# EAGLE design Kite-AVR-ATmega328p (EAGLE 6.5.0)
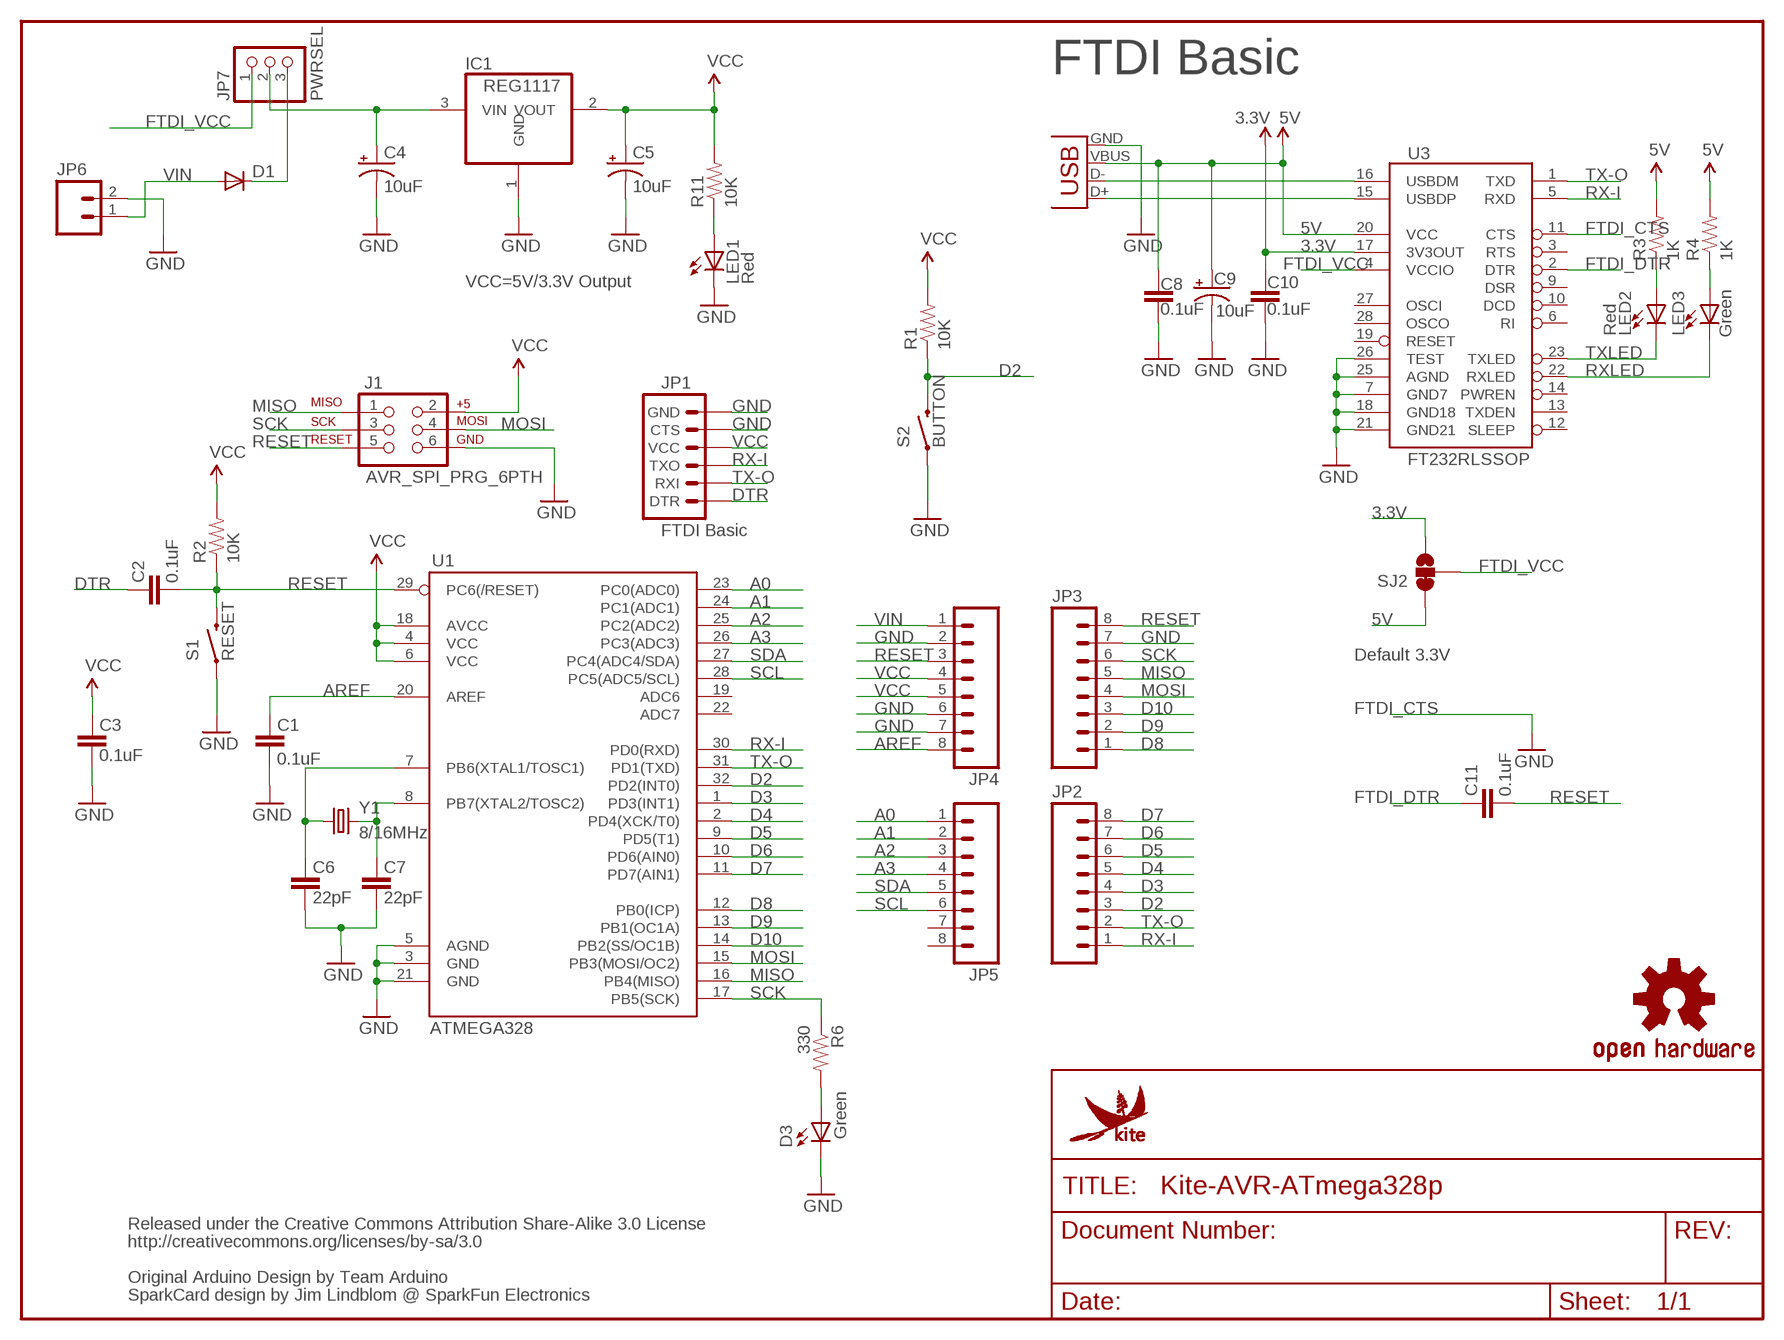
[diagram p0: schematic, sheet 1]

## Parts
C1  0.1uF  CAP0603-CAP  [0603-CAP]
C2  0.1uF  CAP0603-CAP  [0603-CAP]
C3  0.1uF  CAP0603-CAP  [0603-CAP]
C4  10uF  CAP_POL1206  [EIA3216]
C5  10uF  CAP_POL1206  [EIA3216]
C6  22pF  CAP0603-CAP  [0603-CAP]
C7  22pF  CAP0603-CAP  [0603-CAP]
C8  0.1uF  CAP0603-CAP  [0603-CAP]
C9  10uF  CAP_POL1206  [EIA3216]
C10  0.1uF  CAP0603-CAP  [0603-CAP]
C11  0.1uF  CAP0603-CAP  [0603-CAP]
D1  DIODESMA  [SMA-DIODE]
D3  Green  LED0603  [LED-0603]
IC1  REG1117  [SOT223]
J1  AVR_SPI_PRG_6PTH  [2X3]
JP1  FTDI Basic  KITE-FTDI  [KITE-FTDI]
JP2  M081X08  [1X08]
JP3  M081X08  [1X08]
JP4  M081X08  [1X08]
JP5  M081X08  [1X08]
JP6  M02POLAR  [MOLEX-1X2]
JP7  PWRSEL  PINHD-1X3  [1X03]
LED1  Red  LED0603  [LED-0603]
LED2  Red  LED0603  [LED-0603]
LED3  Green  LED0603  [LED-0603]
LOGO1  OSHW-LOGOS  [OSHW-LOGO-S]
R1  10K  RESISTOR0603-RES  [0603-RES]
R2  10K  RESISTOR0603-RES  [0603-RES]
R3  1K  RESISTOR0603-RES  [0603-RES]
R4  1K  RESISTOR0603-RES  [0603-RES]
R6  330  RESISTOR0603-RES  [0603-RES]
R11  10K  RESISTOR0603-RES  [0603-RES]
S1  RESET  SWITCH-MOMENTARY-2-SMD-1101NE  [TACTILE-SWITCH-1101NE]
S2  BUTTON  SWITCH-MOMENTARY-2-SMD-1101NE  [TACTILE-SWITCH-1101NE]
SJ2  SOLDERJUMPER_2WAYS  [SJ_3]
U1  ATMEGA328  ATMEGA168  [TQFP32-08]
U3  FT232RLSSOP  [SSOP28DB]
U$4  KITE-LOGO-AVR-MEDIUM  [KITE-AVR-LOGO-MEDIUM]
X2  USB-SMD-NS  [USB-MINIB-NOSTOP]
Y1  8/16MHz  CRYSTAL5X3  [CRYSTAL-SMD-5X3]

## Nets
3.3V [power]: C10.1 SJ2.3 U3.17(3V3OUT)
5V: C8.1 C9.A(+) R3.2 R4.2 SJ2.1 U3.20(VCC) X2.VBUS
A0: JP5.1 U1.23(PC0(ADC0))
A1: JP5.2 U1.24(PC1(ADC1))
A2: JP5.3 U1.25(PC2(ADC2))
A3: JP5.4 U1.26(PC3(ADC3))
AREF: C1.2 JP4.8 U1.20(AREF)
D2: JP2.3 R1.1 S2.P$2 U1.32(PD2(INT0))
D3: JP2.4 U1.1(PD3(INT1))
D4: JP2.5 U1.2(PD4(XCK/T0))
D5: JP2.6 U1.9(PD5(T1))
D6: JP2.7 U1.10(PD6(AIN0))
D7: JP2.8 U1.11(PD7(AIN1))
D8: JP3.1 U1.12(PB0(ICP))
D9: JP3.2 U1.13(PB1(OC1A))
D10: JP3.3 U1.14(PB2(SS/OC1B))
DTR: C2.2 JP1.1(DTR)
FTDI_CTS: U3.11(CTS) ; supply symbol labelled GND
FTDI_DTR: C11.2 U3.2(DTR)
FTDI_VCC: JP7.1 SJ2.2 U3.4(VCCIO)
GND [power]: C1.1 C3.1 C4.C(-) C5.C(-) C6.1 C7.1 C8.2 C9.C(-) C10.2 D3.C IC1.1(GND) J1.6 JP1.5(CTS) JP1.6(GND) JP3.7 JP4.2 JP4.6 JP4.7 JP6.2 LED1.C S1.P$1 S2.P$1 U1.3(GND) U1.5(AGND) U1.21(GND) U3.7(GND7) U3.18(GND18) U3.21(GND21) U3.25(AGND) U3.26(TEST) X2.GND
MISO: J1.1 JP3.5 U1.16(PB4(MISO))
MOSI: J1.4 JP3.4 U1.15(PB3(MOSI/OC2))
N$1: C7.2 U1.8(PB7(XTAL2/TOSC2)) Y1.3
N$2: C6.2 U1.7(PB6(XTAL1/TOSC1)) Y1.1
N$3: LED2.A R3.1
N$4: C4.A(+) IC1.3(VIN) JP7.2
N$5: LED3.A R4.1
N$7: D3.A R6.2
N$8: D1.C JP7.3
N$38: LED1.A R11.1
RESET: C2.1 C11.1 J1.5 JP3.8 JP4.3 R2.1 S1.P$2 U1.29(PC6(/RESET))
RX-I: JP1.3(TXO) JP2.1 U1.30(PD0(RXD)) U3.5(RXD)
RXLED: LED3.C U3.22(RXLED)
SCK: J1.3 JP3.6 R6.1 U1.17(PB5(SCK))
SCL: JP5.6 U1.28(PC5(ADC5/SCL))
SDA: JP5.5 U1.27(PC4(ADC4/SDA))
TX-O: JP1.2(RXI) JP2.2 U1.31(PD1(TXD)) U3.1(TXD)
TXLED: LED2.C U3.23(TXLED)
USB_D+: U3.15(USBDP) X2.D+
USB_D-: U3.16(USBDM) X2.D-
VCC [power]: C3.2 C5.A(+) IC1.2(VOUT) J1.2 JP1.4(VCC) JP4.4 JP4.5 R1.2 R2.2 R11.2 U1.4(VCC) U1.6(VCC) U1.18(AVCC)
VIN [power]: D1.A JP4.1 JP6.1
Unconnected: JP5.7 JP5.8 U1.19(ADC6) U1.22(ADC7) U3.3(RTS) U3.6(RI) U3.9(DSR) U3.10(DCD) U3.12(SLEEP) U3.13(TXDEN) U3.14(PWREN) U3.19(RESET) U3.27(OSCI) U3.28(OSCO)

## Notes on the sheet
- FTDI Basic
- VCC=5V/3.3V Output
- Default 3.3V
- Released under the Creative Commons Attribution Share-Alike 3.0 License
- http://creativecommons.org/licenses/by-sa/3.0
- Original Arduino Design by Team Arduino
- SparkCard design by Jim Lindblom @ SparkFun Electronics

## Library data of the parts
C1-C3 C6-C8 C10 C11 = SparkFun:CAP: Capacitor Standard 0603 ceramic capacitor, and 0.1" leaded capacitor.
C4 C5 C9 = SparkFun:CAP_POL: Capacitor Polarized These are standard SMD and PTH capacitors. Normally 10uF, 47uF, and 100uF in electrolytic and tantalum varieties. Always verify the external diameter of the through hole cap, it varies with capacity, voltage, and manufacturer. The EIA devices should be standard.
D1 = SparkFun-DiscreteSemi:DIODE: Diode These are standard reverse protection diodes and small signal diodes. SMA package can handle up to about 1A. SOD-323 can handle about 200mA. What the SOD-323 package when ordering, there are some mfgs out there that are 5-pin packages.
D3 LED1-LED3 = SparkFun:LED: LEDs Standard schematic elements and footprints for 5mm, 3mm, 1206, and 0603 sized LEDs. 5mm - Spark Fun Electronics SKU : COM-00529 (and others)
IC1 = burr-brown:REG1117: 800mA and 1A Low Dropout (LDO) Positive Regulator 1.8V, 2.5V, 2.85V, 3.3V, 5V, and Adj; MPN: REG1117; OC_FARNELL: 1097566; OC_NEWARK: 14P6981
J1 = SparkFun-Connectors:AVR_SPI_PRG_6: AVR ISP 6 Pin This is the reduced ISP connector for AVR programming. Common on Arduino. This footprint will take up less PCB space and can be used with a 10-pin to 6-pin adapter such as SKU: BOB-08508
JP1 = Kite:KITE-FTDI
JP2-JP5 = SparkFun-Connectors:M08: Header 8 Standard 8-pin 0.1" header. Use with straight break away headers (SKU : PRT-00116), right angle break away headers (PRT-00553), swiss pins (PRT-00743), machine pins (PRT-00117), and female headers (PRT-00115).
JP6 = SparkFun-Connectors:M02: Header 2 Standard 2-pin 0.1" header. Use with straight break away headers (SKU : PRT-00116), right angle break away headers (PRT-00553), swiss pins (PRT-00743), machine pins (PRT-00117), and female headers (PRT-00115). Molex polarized connector foot print use with SKU : PRT-08233 with associated crimp pins and housings.
JP7 = adafruit:PINHD-1X3: PIN HEADER
LOGO1 = SparkFun-Aesthetics:OSHW-LOGO: Open Source Hardware Logo This logo indicates the piece of hardware it is found on incorporates a OSHW license and/or adheres to the definition of open source hardware found here: http://freedomdefined.org/OSHW
R1-R4 R6 R11 = SparkFun:RESISTOR: Resistor Basic schematic elements and footprints for 0603, 1206, and PTH resistors.
S1 S2 = SparkFun-Electromechanical:SWITCH-MOMENTARY-2: Various NO switches- pushbuttons, reed, etc
SJ2 = SparkFun:SOLDERJUMPER_2WAY: Solder Jumper 2 way solder jumper
U1 = SparkFun:ATMEGA168
U3 = SparkFun:FT232RL: USB UART FT232RL 4th Generation USB UART (USB <-> Serial) Controller. Spark Fun Electronics SKU : COM-00650
U$4 = Kite:KITE-LOGO
X2 = SparkFun:USB: USB Connectors USB-B-PTH is fully proven SKU : PRT-00139 USB-miniB is fully proven SKU : PRT-00587 USB-A-PCB is untested. USB-A-H is throughly reviewed, but untested. Spark Fun Electronics SKU : PRT-00437 USB-B-SMT is throughly reviewed, but untested. Needs silkscreen touching up. USB-A-S has not been used/tested USB-MB-H has not been used/tested
Y1 = SparkFun-FreqCtrl:CRYSTAL: Various standard crystals. Proven footprints. Spark Fun Electronics SKU : COM-00534

## Net classes
0 default: width 0.203 mm
1 power: width 0.254 mm

## Board
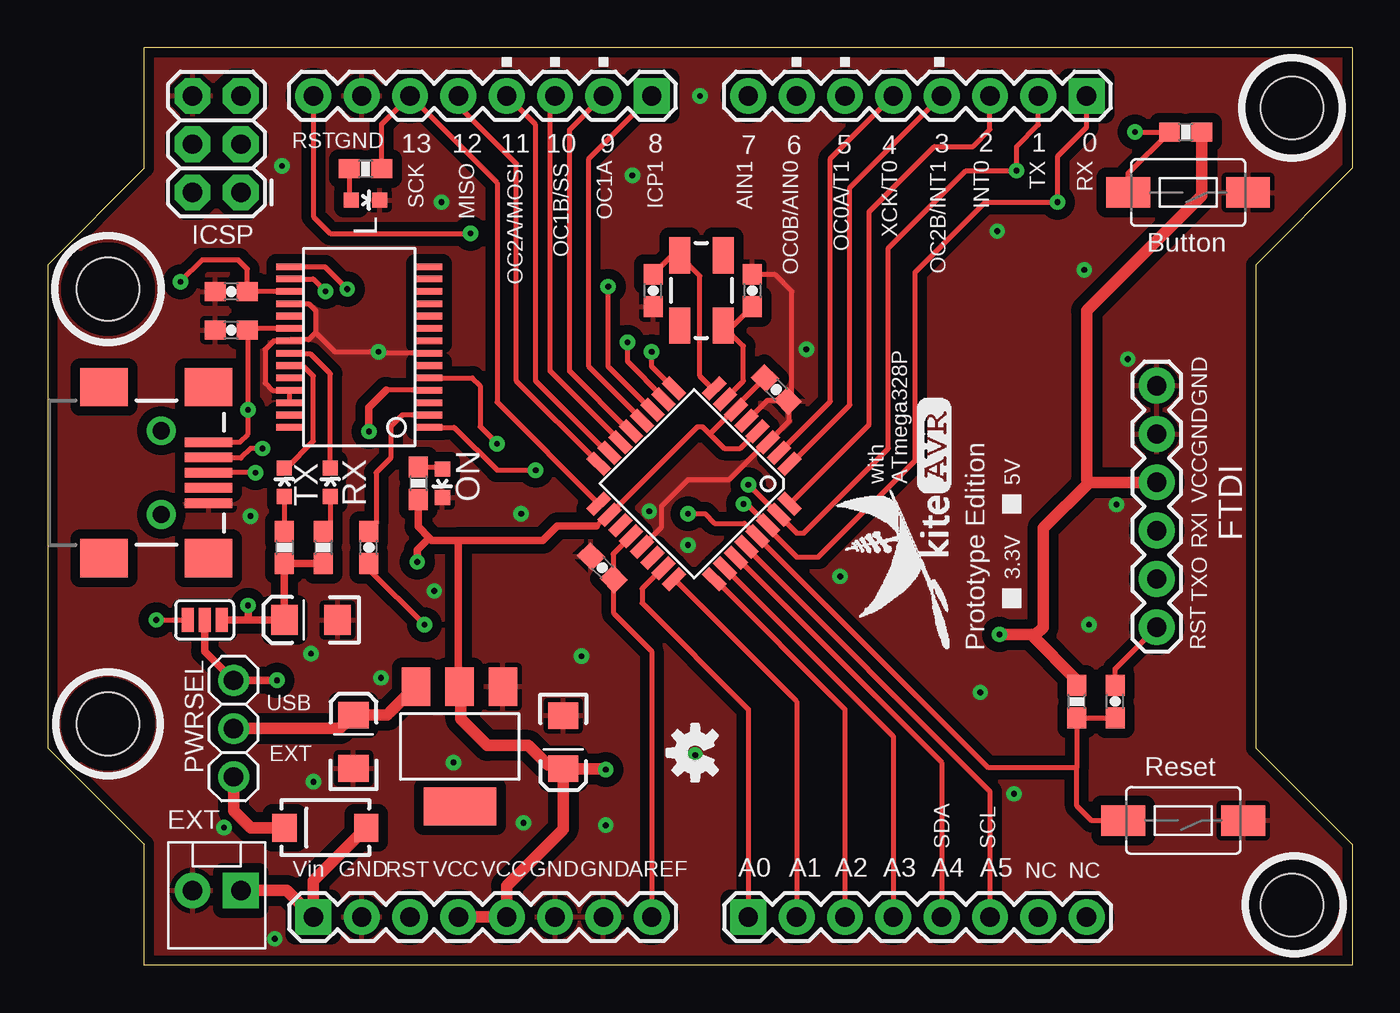
[diagram p1: board, top side]
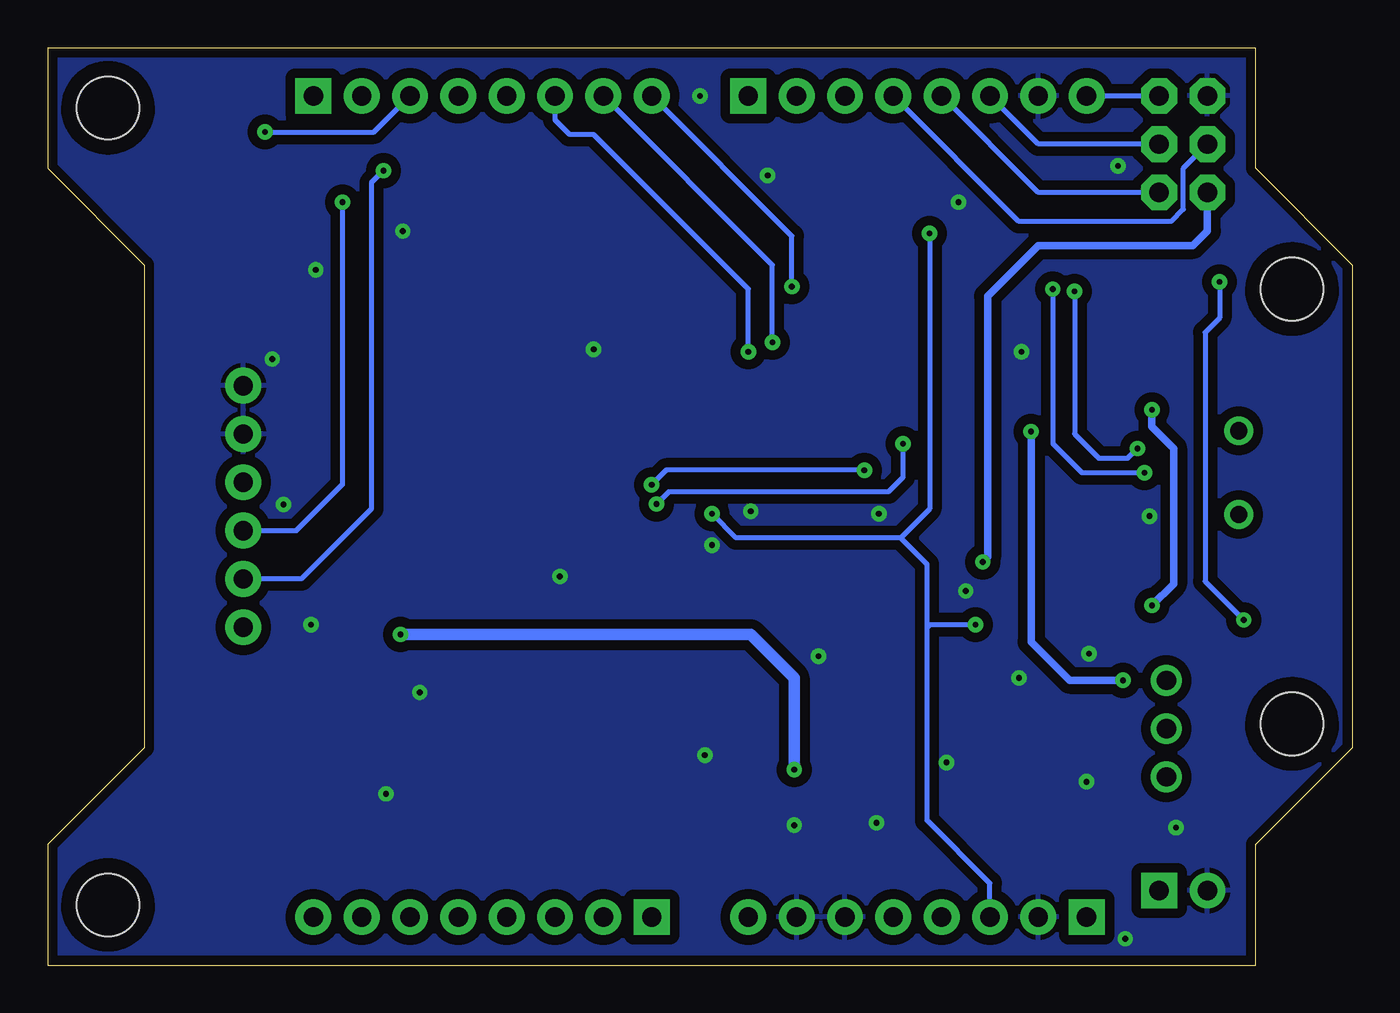
[diagram p2: board, bottom side, seen from below]

Size 68.58 x 48.26 mm. Coordinates in mm from the lower left corner, seen from the top.
Outline: 68.58,48.26 5.08,48.26 5.08,41.91 0,36.83 0,11.43 5.08,6.35 5.08,0 68.58,0 68.58,6.35 63.5,11.43 63.5,36.83 68.58,41.91 68.58,48.26
Copper layers (1*16): Top 0.035mm / dielectric 1.5mm / Bottom 0.035mm
Design rules "SparkFun *": minimum track width 8mil, minimum drill 20mil, track to track 8mil, track to pad 8mil, pad to pad 8mil, via to via 8mil, smd to smd 8mil, copper to edge 8mil, drill to drill 8mil, minimum pad ring 12mil, minimum via ring 10mil, stop-mask expansion 4mil, vias tented up to drill 20mil, thermal gap 10mil

### Footprints (pad centres in the part's own frame; a part is rotated, then mirrored left to right if it is on the bottom)
0603-CAP = smd 1.1 x 1: 1 -0.85,0; 2 0.85,0
EIA3216 = smd 1.4 x 1.6: A 1.4,0; C -1.4,0
SMA-DIODE = smd 1.27 x 1.47: A -2.15,0; C 2.15,0
LED-0603 = smd 0.8 x 0.8: A 0,-0.75; C 0,0.75
SOT223 = smd 1.499 x 2.007: 1 -2.261,-3.15; 2 0.025,-3.15; 3 2.311,-3.15 | smd 3.81 x 2.007: 4 0,3.15
2X3 = drill 1.016 pad 1.88 octagon: 1 0,0; 2 0,2.54; 3 2.54,0; 4 2.54,2.54; 5 5.08,0; 6 5.08,2.54
KITE-FTDI = drill 1.016 pad 1.88: 1 0,0; 2 2.54,0; 3 5.08,0; 4 7.62,0; 5 10.16,0; 6 12.7,0
1X08 = drill 1.016 pad 1.88 square: 1 0,0 | drill 1.016 pad 1.88: 2 2.54,0; 3 5.08,0; 4 7.62,0; 5 10.16,0; 6 12.7,0; 7 15.24,0; 8 17.78,0
MOLEX-1X2 = drill 1.016 pad 1.88 square: 1 0,0 | drill 1.016 pad 1.88: 2 2.54,0
1X03 = drill 1.016: 1 -2.54,0; 2 0,0; 3 2.54,0
0603-RES = smd 1.1 x 1: 1 -0.85,0; 2 0.85,0
TACTILE-SWITCH-1101NE = smd 2.3 x 1.6: P$1 -3.15,0; P$2 3.15,0
SJ_3 = smd 0.635 x 1.27: 1 -0.889,0; 2 0,0; 3 0.889,0
TQFP32-08 = smd 1.27 x 0.559: 1 -4.293,2.8; 2 -4.293,2; 3 -4.293,1.2; 4 -4.293,0.4; 5 -4.293,-0.4; 6 -4.293,-1.2; 7 -4.293,-2; 8 -4.293,-2.8; 17 4.293,-2.8; 18 4.293,-2; 19 4.293,-1.2; 20 4.293,-0.4; 21 4.293,0.4; 22 4.293,1.2; 23 4.293,2; 24 4.293,2.8 | smd 0.559 x 1.27: 9 -2.8,-4.293; 10 -2,-4.293; 11 -1.2,-4.293; 12 -0.4,-4.293; 13 0.4,-4.293; 14 1.2,-4.293; 15 2,-4.293; 16 2.8,-4.293; 25 2.8,4.293; 26 2,4.293; 27 1.2,4.293; 28 0.4,4.293; 29 -0.4,4.293; 30 -1.2,4.293; 31 -2,4.293; 32 -2.8,4.293
SSOP28DB = smd 0.348 x 1.397: 1 -4.225,-3.656; 2 -3.575,-3.656; 3 -2.925,-3.656; 4 -2.275,-3.656; 5 -1.625,-3.656; 6 -0.975,-3.656; 7 -0.325,-3.656; 8 0.325,-3.656; 9 0.975,-3.656; 10 1.625,-3.656; 11 2.275,-3.656; 12 2.925,-3.656; 13 3.575,-3.656; 14 4.225,-3.656; 15 4.225,3.656; 16 3.575,3.656; 17 2.925,3.656; 18 2.275,3.656; 19 1.625,3.656; 20 0.975,3.656; 21 0.325,3.656; 22 -0.325,3.656; 23 -0.975,3.656; 24 -1.625,3.656; 25 -2.275,3.656; 26 -2.925,3.656; 27 -3.575,3.656; 28 -4.225,3.656
STAND-OFF = hole 3.302: 0,0
USB-MINIB-NOSTOP = smd 2.5 x 0.5: D+ 2.5,0; D- 2.5,0.8; GND 2.5,-1.6; ID 2.5,-0.8; VBUS 2.5,1.6 | smd 2.5 x 2: G1 -3,-4.5; G2 -3,4.5; G3 2.5,4.5; G4 2.5,-4.5 | drill 0.9 pad 0.8: H1 0,2.2 | drill 0.9 pad 0.787: H2 0,-2.2
CRYSTAL-SMD-5X3 = smd 1.9 x 1.1: 1 -1.85,-1.15; 2 1.85,-1.15; 3 1.85,1.15; 4 -1.85,1.15

### Placement (x,y rotation side)
C1  29.16,20.9 315 top
C2  56.11,13.87 90 top
C3  38.3,30.28 135 top
C4  16.08,11.76 90 top
C5  27.1,11.73 270 top
C6  37.03,35.48 270 top
C7  31.83,35.48 90 top
C8  9.65,33.4 180 top
C9  13.84,18.16 180 top
C10  9.65,35.43 180 top
C11  16.89,21.97 90 top
D1  14.6,7.24 180 top
D3  16.71,40.23 270 top
IC1  21.67,11.51 180 top
J1  10.16,40.64 90 top
JP1  58.29,17.78 90 top
JP2  54.61,45.72 180 top
JP3  31.75,45.72 180 top
JP4  13.97,2.54 0 top
JP5  36.83,2.54 0 top
JP6  10.16,3.94 180 top
JP7  9.78,12.45 270 top
LED1  20.75,25.35 180 top
LED2  12.45,25.4 0 top
LED3  14.86,25.4 0 top
LOGO1  34.04,11.18 90 top
R1  59.82,43.81 0 top
R2  54.1,13.87 90 top
R3  12.45,21.97 270 top
R4  14.48,21.97 270 top
R6  16.71,41.88 180 top
R11  19.48,25.35 270 top
S1  59.69,7.62 180 top
S2  59.94,40.64 180 top
SJ2  8.25,18.16 180 top
U1  33.99,25.32 225 top
U3  16.38,32.51 90 top
U$2  [STAND-OFF]  3.17,35.56 270 top
U$3  [STAND-OFF]  65.41,45.09 270 top
U$4  47.47,16.66 90 top
U$5  [STAND-OFF]  3.17,12.7 270 top
U$6  [STAND-OFF]  65.41,3.17 270 top
X2  5.97,25.91 0 top
Y1  34.37,35.48 90 top

### Tracks (layer width: path | path; a pad name or v marks a point on that pad's centre or on a via)
3.3V  (via drill 0.3)
  Top 0.254: U3.17 C10.1 10.5,36.62 10.03,37.08 8.13,37.08 v6.99,35.94 | v5.71,18.16 SJ2.3
  Top 0.406: C10.1
  Bottom 0.254: v5.71,18.16 7.75,20.19 7.75,33.27 6.99,34.04 v6.99,35.94
5V  (via drill 0.3)
  Top 0.254: U3.20 10.5,33.49 | X2.VBUS 10.11,27.51 10.54,27.94 v10.54,29.21 10.54,33.36 C8.1 | C9.A
  Top 0.406: 10.5,33.49 C8.1 | R4.2 R3.2 C9.A | SJ2.1 10.54,18.16 | 10.54,18.16 C9.A | v10.54,18.92 10.54,18.16
  Bottom 0.406: v10.54,29.21 10.54,28.32 9.4,27.18 9.4,20.07 v10.54,18.92
A0
  Top 0.254: U1.23 32.3,20.87 31.24,19.81 31.24,19.05 36.83,13.46 JP5.1
A1
  Top 0.254: U1.24 39.37,13.87 JP5.2
A2
  Top 0.254: U1.25 35.06,20.31 41.91,13.46 JP5.3
A3
  Top 0.254: U1.26 44.45,12.03 JP5.4
AREF
  Top 0.254: JP4.8 31.75,16.51 29.76,18.5 C1.2 29.72,20.34 29.72,21.62 U1.20
D2  (via drill 0.3)
  Top 0.254: U1.32 43.18,28.45 43.18,39.62 46.61,43.05 48.64,43.05 49.53,43.94 JP2.3 | S2.P$2 56.79,41.64 R1.1 v57.15,43.81
  Bottom 0.254: v57.15,43.81 51.43,43.81 JP2.3
D3
  Top 0.254: U1.1 39.08,26.38 42.16,29.46 42.16,40.89 JP2.4
D4
  Top 0.254: JP2.5 41.15,42.42 41.15,29.66 U1.2
D5  (via drill 0.3)
  Top 0.254: 32.91,30.34 31.75,31.5 v31.75,32.26
  Top 0.406: U1.9 32.91,30.34
  Bottom 0.254: JP2.6 41.91,44.45 41.15,43.69 39.88,43.69 31.75,35.56 31.75,32.51
  Bottom 0.406: v31.75,32.26 31.75,32.51
D6  (via drill 0.3)
  Top 0.254: v30.48,32.77 30.48,31.75 32.36,29.87 U1.10
  Bottom 0.254: v30.48,32.77 30.48,36.83 JP2.7
D7  (via drill 0.3)
  Top 0.254: 31.75,29.21 29.46,31.5 v29.46,35.69
  Top 0.406: U1.11 31.75,29.21
  Bottom 0.254: v29.46,35.69 29.46,38.35 JP2.8
D8
  Top 0.254: U1.12 31.23,28.71 28.45,31.5 28.45,42.42 JP3.1
D9
  Top 0.254: 30.6,28.08 27.43,31.24 27.43,43.94 JP3.2
  Top 0.406: U1.13 30.6,28.08
D10
  Top 0.254: 30.1,27.56 26.42,31.24 26.42,45.47 JP3.3 | U1.14 30.1,27.56 | 30.1,27.56
DTR
  Top 0.254: C2.2 56.11,15.6 JP1.1
FTDI_DTR
  Top 0.254: U3.2 18.65,28.94 18.03,28.32 18.03,26.67 17.27,25.91 17.27,23.2 C11.2
FTDI_VCC  (via drill 0.3)
  Top 0.254: U3.4 17.79,30.24
  Top 0.406: 17.79,30.24 16.89,29.34 v16.89,28.07 | SJ2.2 8.25,16.51 9.4,15.37 JP7.1 v12.06,14.99
  Bottom 0.406: v16.89,28.07 16.89,17.02 14.86,14.99 v12.06,14.99
GND  (via drill 0.3)
  Top 0.254: U1.5 36.77,28.64 37.85,29.72 38.86,29.72 C3.1 | 38.95,29.72 C3.1 | U1.21 32.26,23.03 32.26,24.13 33.65,25.53 35.81,25.53 37.8,27.51 U1.3 38.99,28.63 38.99,29.59 C3.1 | 38.99,29.76 C3.1 | C6.1 38.21,36.33 39.12,35.43 39.12,29.89 C3.1 | U3.26 U3.25 12.72,30.23 11.81,30.23 11.43,30.61 11.43,32.38 11.88,32.84 U3.21 12.78,32.89 13.72,32.89 14.1,33.27 | U3.7 17.47,32.19 v17.4,32.26 15.11,32.26 14.1,33.27 | U3.18 13.73,34.79 14.1,34.42 14.1,33.27
  other vias: 24.89,23.75 34.29,45.72 30.73,41.53 39.88,32.38 13.97,9.65 21.34,10.67 41.66,20.45 29.34,7.37 17.53,15.11 20.7,40.13 34.04,11.05 28.07,16.26 54.74,17.91 25.02,7.49 49.02,14.35 56.18,24.23 50.8,9.02 11.94,1.4 9.27,7.24 49.91,38.61 12.32,42.04 56.77,31.88 54.48,36.58 31.62,23.88 33.65,22.1 10.67,23.62 20.32,19.68 13.84,16.38
  pour Bottom (isolate 0.508): 68.53,48.18 -0.23,48.18 -0.15,0 68.5,0
  pour Top (isolate 0.508): 68.66,48.18 -0.23,48.18 -0.15,0 68.63,0
MISO
  Top 0.254: U1.16 28.97,26.4 24.64,30.73 24.64,42.16 21.59,45.21 JP3.5
  Bottom 0.254: 21.65,45.66 JP3.5 16.51,40.64 J1.1
MOSI
  Top 0.254: 29.44,26.95 25.65,30.73 25.65,44.2 JP3.4
  Top 0.406: U1.15 29.44,26.95
  Bottom 0.254: 7.62,43.05 J1.4 8.89,41.91 8.89,39.75 9.52,39.12 17.53,39.12 JP3.4
N$1
  Top 0.254: U1.8 34.94,30.34 34.29,30.99 34.29,36.26 Y1.3 32.83,37.33 C7.2
N$2
  Top 0.254: U1.7 35.61,29.77 36.58,30.73 36.58,32.57 Y1.1 36.03,33.63 C6.2
N$3
  Top 0.254: LED2.A R3.1
N$4
  Top 0.406: 17.86,13.16 17.99,13.29
  Top 0.61: 19.23,14.53 IC1.3 | 19.3,14.61 IC1.3 | 17.99,13.29 IC1.3 | 17.86,13.16 C4.A 15.36,12.45 JP7.2
N$5
  Top 0.254: LED3.A 14.86,23.2 R4.1
N$7
  Top 0.254: R6.2 15.86,40.33 D3.A
N$8
  Top 0.61: D1.C 10.67,7.24 9.78,8.13 JP7.3
N$38
  Top 0.254: R11.1 20.65,26.2 LED1.A
RESET  (via drill 0.3)
  Top 0.254: JP3.8 13.97,39.37 14.86,38.48 v22.23,38.48 | C2.1 R2.1 54.1,10.41 | 54.1,10.41 49.4,10.41 37.3,22.51 U1.29 36.63,23.24 35.05,23.24 34.54,23.75 v33.65,23.75 | 54.1,10.41 54.1,8.38 54.86,7.62 S1.P$2 56.54,7.64 56.64,7.75 56.77,7.62 56.77,7.75 | 16.89,20.83 v19.81,17.91
  Top 0.406: C11.1 16.89,20.83
  Bottom 0.254: v22.23,38.48 22.23,24 23.75,22.48 | 23.75,22.48 32.38,22.48 v33.65,23.75 | JP3.8 J1.5 | JP4.3 19.05,4.32 22.35,7.62 22.35,17.78 | 22.35,17.78 22.35,21.08 23.75,22.48 | v19.81,17.91 22.23,17.91 22.35,17.78
RX-I  (via drill 0.3)
  Top 0.254: JP2.1 54.61,44.07 53.09,42.55 v53.09,40.13 49.28,40.13 45.59,36.45 45.59,26.54 40.51,21.46 39.37,21.46 37.87,22.96 U1.30 36.75,24.26 v36.58,24.26 | U3.5 22.33,30.89 22.73,30.48 22.73,28.32 v23.62,27.43
  Bottom 0.254: JP1.3 55.5,22.86 53.09,25.27 v53.09,40.13 | v23.62,27.43 23.62,25.65 24.38,24.89 35.94,24.89 v36.58,24.26
RXLED
  Top 0.254: LED3.C 14.86,31.11 13.84,32.13 12.78,32.13 U3.22
SCK
  Top 0.254: U1.17 23.62,29.62 23.62,41.15 JP3.6 17.56,44.23 R6.1
  Bottom 0.254: J1.3 16.51,43.18 JP3.6
SCL
  Top 0.254: U1.28 36.74,21.94 49.53,9.14 JP5.6
SDA
  Top 0.254: JP5.5 46.99,10.67 36.22,21.44 U1.27 36.09,21.44
TX-O  (via drill 0.3)
  Top 0.254: JP2.2 52.07,44.2 50.93,43.05 v50.93,41.78 48.26,41.78 44.2,37.72 44.2,27.18 39.75,22.73 39.37,22.73 38.53,23.58 38.53,23.7 U1.31 38.4,23.7 v36.83,25.27 | U3.1 21.37,28.29 23.62,26.04 v25.65,26.04
  Bottom 0.254: JP1.2 55.24,20.32 51.56,24 51.56,41.15 v50.93,41.78 | v25.65,26.04 36.07,26.04 v36.83,25.27
TXLED
  Top 0.254: LED2.C 12.56,26.15 13.97,27.56 13.97,30.99 13.46,31.5 12.77,31.5 U3.23
USB_D+  (via drill 0.3)
  Top 0.254: U3.15 14.57,36.74 v15.75,35.56 | v10.92,25.91 X2.D+
  Bottom 0.254: v15.75,35.56 15.75,27.43 14.22,25.91 v10.92,25.91
USB_D-  (via drill 0.3)
  Top 0.254: U3.16 13.95,36.09 v14.6,35.43 | v11.3,27.18 10.67,27.18 10.16,26.67 8.51,26.67 X2.D-
  Bottom 0.254: v14.6,35.43 14.6,27.94 13.33,26.67 11.81,26.67 v11.3,27.18
VCC  (via drill 0.3)
  Top 0.254: 34.8,27.94 36.07,29.21 U1.6 36.17,29.35 C3.2 | 34.8,27.94 35.56,27.18 36.4,27.18 U1.4 | 34.8,27.94 34.42,28.32 34.16,28.32 29.55,23.7 U1.18 29.42,23.7 28.83,23.11 | R2.2 54.1,14.99 | 54.61,25.53 54.74,25.4
  Top 0.406: R11.2 19.48,23.06 20.07,22.48 | 20.07,22.48 20.19,22.35 21.59,22.35 | 28.83,23.11 26.8,23.11 26.04,22.35 21.59,22.35 | 21.59,22.35 21.59,14.22 | v19.43,21.21 19.43,21.84 20.07,22.48
  Top 0.61: JP4.4 JP4.5 24.13,4.19 27.1,7.16 C5.A | 19.43,24.45 R11.2 | 21.72,14.1 21.72,12.95 23.11,11.56 25.27,11.56 26.29,10.54 26.9,10.54 C5.A | 21.72,14.1 21.72,14.58 IC1.2 | v50.04,17.4 51.69,17.4 | 51.69,17.4 51.94,17.4 52.32,17.78 52.32,22.99 54.74,25.4 JP1.4 | C5.A 29.29,10.34 v29.34,10.29 | 21.59,14.22 21.72,14.1 | 54.1,14.99 51.69,17.4 | 54.61,25.53 54.61,34.42 60.67,40.47 R1.2
  Bottom 0.406: J1.2 7.62,38.61 8.38,37.85 16.51,37.85 19.18,35.18 19.18,21.46 v19.43,21.21
  Bottom 0.61: v50.04,17.4 31.62,17.4 29.34,15.11 v29.34,10.29
VIN
  Top 0.61: JP6.1 10.92,3.94 12.57,3.94 JP4.1 13.97,3.94 13.97,4.45 D1.A

### Text on the board
tPlace: RST | GND | 13 | 12 | 11 | 10 | 9 | 8 | 7 | 6 | 5 | 4 | 3 | 2 | 1 | 0 | SCK | MISO | OC2A/MOSI | OC1B/SS | OC1A | ICP1 | AIN1 | OC0B/AIN0 | OC0A/T1 | XCK/T0 | OC2B/INT1 | INT0 | TX | RX | ICSP | L | Button | GND | GND | with / ATmega328P | 5V | TX | RX | ON | VCC | RXI | FTDI | 3.3V | TXO | Prototype Edition | RST | USB | EXT | PWRSEL | Reset | EXT | A0 | A1 | A2 | A3 | SDA | A4 | SCL | A5 | Vin | GND | RST | VCC | VCC | GND | GND | AREF | NC | NC